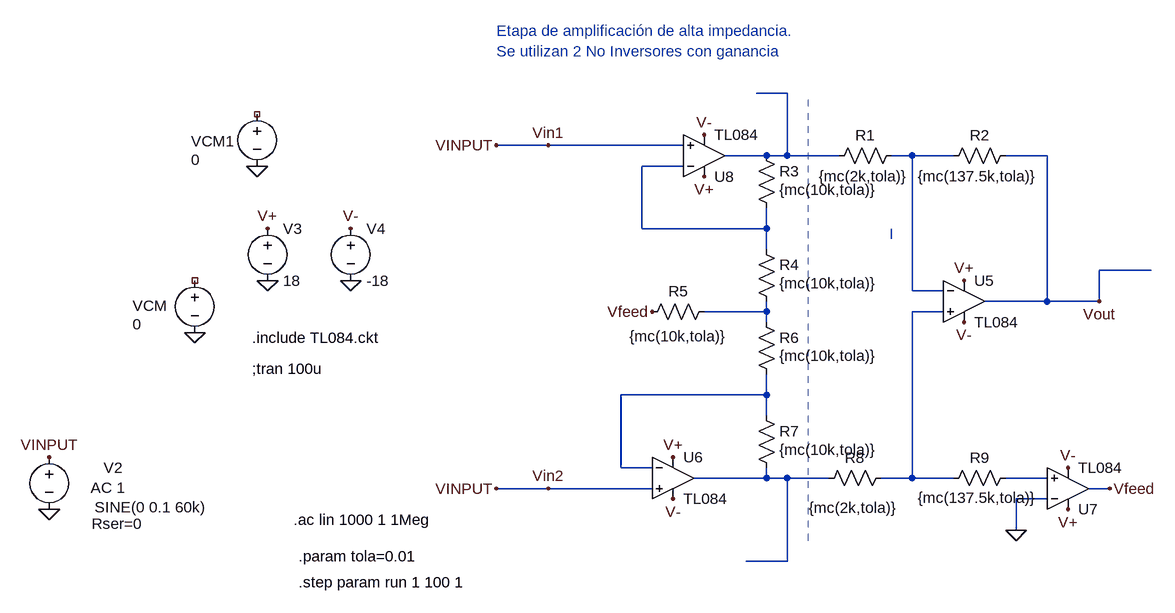
[diagram p0: schematic Draft1.asc]
Draft1.asc, the LTspice schematic file:
Version 4
SHEET 1 1008 680
WIRE 208 -240 160 -240
WIRE -160 -160 -240 -160
WIRE 48 -160 -160 -160
WIRE 176 -144 112 -144
WIRE 208 -144 208 -240
WIRE 208 -144 176 -144
WIRE 288 -144 208 -144
WIRE 400 -144 368 -144
WIRE 464 -144 400 -144
WIRE 608 -144 544 -144
WIRE 48 -128 -16 -128
WIRE -16 -32 -16 -128
WIRE 176 -32 176 -64
WIRE 176 -32 -16 -32
WIRE 176 0 176 -32
WIRE 768 32 688 32
WIRE 400 64 400 -144
WIRE 448 64 400 64
WIRE 608 80 608 -144
WIRE 608 80 512 80
WIRE 688 80 688 32
WIRE 688 80 608 80
WIRE 176 96 176 80
WIRE 176 96 80 96
WIRE 448 96 400 96
WIRE 176 112 176 96
WIRE 176 224 176 192
WIRE 176 224 -48 224
WIRE 176 256 176 224
WIRE -48 336 -48 224
WIRE 0 336 -48 336
WIRE 176 352 176 336
WIRE 176 352 64 352
WIRE 208 352 176 352
WIRE 272 352 208 352
WIRE 400 352 400 96
WIRE 400 352 352 352
WIRE 464 352 400 352
WIRE 608 352 544 352
WIRE -160 368 -240 368
WIRE 0 368 -160 368
WIRE 704 368 672 368
WIRE 608 384 560 384
WIRE 560 432 560 384
WIRE 208 480 208 352
WIRE 208 480 144 480
FLAG 560 432 0
FLAG 704 368 Vfeed
FLAG 0 96 Vfeed
FLAG -704 128 0
FLAG -608 -128 0
FLAG 688 80 Vout
FLAG -464 48 0
FLAG -592 48 0
FLAG -592 -32 V+
FLAG 80 -112 V+
FLAG 480 48 V+
FLAG 640 400 V+
FLAG 32 320 V+
FLAG -464 -32 V-
FLAG 80 -176 V-
FLAG 480 112 V-
FLAG 640 336 V-
FLAG 32 384 V-
FLAG -160 368 Vin2
FLAG -160 -160 Vin1
FLAG -928 400 0
FLAG -928 320 VINPUT
FLAG -240 368 VINPUT
FLAG -240 -160 VINPUT
DATAFLAG 768 32 ""
DATAFLAG 160 -240 ""
DATAFLAG 144 480 ""
SYMBOL res 160 -16 R0
WINDOW 3 36 68 Left 2
SYMATTR Value {mc(10k,tola)}
SYMATTR InstName R4
SYMATTR SpiceLine tol=1
SYMBOL res 160 96 R0
WINDOW 3 36 68 Left 2
SYMATTR Value {mc(10k,tola)}
SYMATTR InstName R6
SYMATTR SpiceLine tol=1
SYMBOL res 160 240 R0
WINDOW 3 36 68 Left 2
SYMATTR Value {mc(10k,tola)}
SYMATTR InstName R7
SYMATTR SpiceLine tol=1
SYMBOL res 160 -160 R0
WINDOW 3 36 68 Left 2
SYMATTR Value {mc(10k,tola)}
SYMATTR InstName R3
SYMATTR SpiceLine tol=1
SYMBOL res 384 -160 R90
WINDOW 0 0 56 VBottom 2
WINDOW 3 63 59 VBottom 2
SYMATTR InstName R1
SYMATTR Value {mc(2k,tola)}
SYMATTR SpiceLine tol=1
SYMBOL res 560 -160 R90
WINDOW 0 0 56 VBottom 2
WINDOW 3 63 59 VBottom 2
SYMATTR InstName R2
SYMATTR Value {mc(137.5k,tola)}
SYMATTR SpiceLine tol=1
SYMBOL res 368 336 R90
WINDOW 0 0 56 VBottom 2
WINDOW 3 77 59 VBottom 2
SYMATTR InstName R8
SYMATTR Value {mc(2k,tola)}
SYMATTR SpiceLine tol=1
SYMBOL res 96 80 R90
WINDOW 0 0 56 VBottom 2
WINDOW 3 69 56 VBottom 2
SYMATTR InstName R5
SYMATTR Value {mc(10k,tola)}
SYMATTR SpiceLine tol=1
SYMBOL res 560 336 R90
WINDOW 0 0 56 VBottom 2
WINDOW 3 62 59 VBottom 2
SYMATTR InstName R9
SYMATTR Value {mc(137.5k,tola)}
SYMATTR SpiceLine tol=1
SYMBOL voltage -928 304 R0
WINDOW 0 84 32 Left 2
WINDOW 3 70 93 Left 2
WINDOW 123 64 63 Left 2
WINDOW 39 65 118 Left 2
SYMATTR InstName V2
SYMATTR Value SINE(0 0.1 60k)
SYMATTR Value2 AC 1
SYMATTR SpiceLine Rser=0
SYMBOL voltage -608 -224 R0
WINDOW 0 -102 58 Left 2
WINDOW 123 0 0 Left 0
WINDOW 39 0 0 Left 0
WINDOW 3 -102 86 Left 2
SYMATTR InstName VCM1
SYMATTR Value 0
SYMBOL voltage -704 32 R0
WINDOW 0 -96 55 Left 2
WINDOW 123 0 0 Left 0
WINDOW 39 0 0 Left 0
WINDOW 3 -96 83 Left 2
SYMATTR InstName VCM
SYMATTR Value 0
SYMBOL Opamps\\opamp2 480 16 R0
SYMATTR InstName U5
SYMATTR Value TL084
SYMBOL Opamps\\opamp2 32 288 R0
SYMATTR InstName U6
SYMATTR Value TL084
SYMBOL Opamps\\opamp2 640 432 M180
SYMATTR InstName U7
SYMATTR Value TL084
SYMBOL Opamps\\opamp2 80 -80 M180
SYMATTR InstName U8
SYMATTR Value TL084
SYMBOL voltage -592 -48 R0
WINDOW 123 0 0 Left 0
WINDOW 39 0 0 Left 0
SYMATTR InstName V3
SYMATTR Value 18
SYMBOL voltage -464 -48 R0
WINDOW 123 0 0 Left 0
WINDOW 39 0 0 Left 0
SYMATTR InstName V4
SYMATTR Value -18
TEXT -616 136 Left 2 !.include TL084.ckt
TEXT -616 184 Left 2 !;tran 100u
TEXT -240 -336 Left 2 ;Etapa de amplificación de alta impedancia.\nSe utilizan 2 No Inversores con ganancia
TEXT -552 416 Left 2 !.ac lin 1000 1 1Meg
TEXT -544 472 Left 2 !.param tola=0.01
TEXT -544 512 Left 2 !.step param run 1 100 1
LINE Normal 240 448 240 -240 1
CIRCLE Normal 368 -16 368 -32 1

The netlist it stands for:
* Draft1.asc
R4 N003 N004 {mc(10k,tola)} tol=1
R6 N004 N006 {mc(10k,tola)} tol=1
R7 N006 N007 {mc(10k,tola)} tol=1
R3 N001 N003 {mc(10k,tola)} tol=1
R1 N002 N001 {mc(2k,tola)} tol=1
R2 Vout N002 {mc(137.5k,tola)} tol=1
R8 N005 N007 {mc(2k,tola)} tol=1
R5 N004 Vfeed {mc(10k,tola)} tol=1
R9 N008 N005 {mc(137.5k,tola)} tol=1
V2 VINPUT 0 SINE(0 0.1 60k) AC 1 Rser=0
VCM1 NC_01 0 0
VCM NC_02 0 0
XU5 N005 N002 V+ V- Vout TL084  ; pins In+ In- V+ V- OUT
XU6 VINPUT N006 V+ V- N007 TL084  ; pins In+ In- V+ V- OUT
XU7 N008 0 V+ V- Vfeed TL084  ; pins In+ In- V+ V- OUT
XU8 VINPUT N003 V+ V- N001 TL084  ; pins In+ In- V+ V- OUT
V3 V+ 0 18
V4 V- 0 -18
.include TL084.ckt
;tran 100u
* Etapa de amplificación de alta impedancia.
* Se utilizan 2 No Inversores con ganancia
.ac lin 1000 1 1Meg
.param tola=0.01
.step param run 1 100 1
.backanno
.end